# EAGLE design brick_serial_usb (EAGLE 7.4.0)
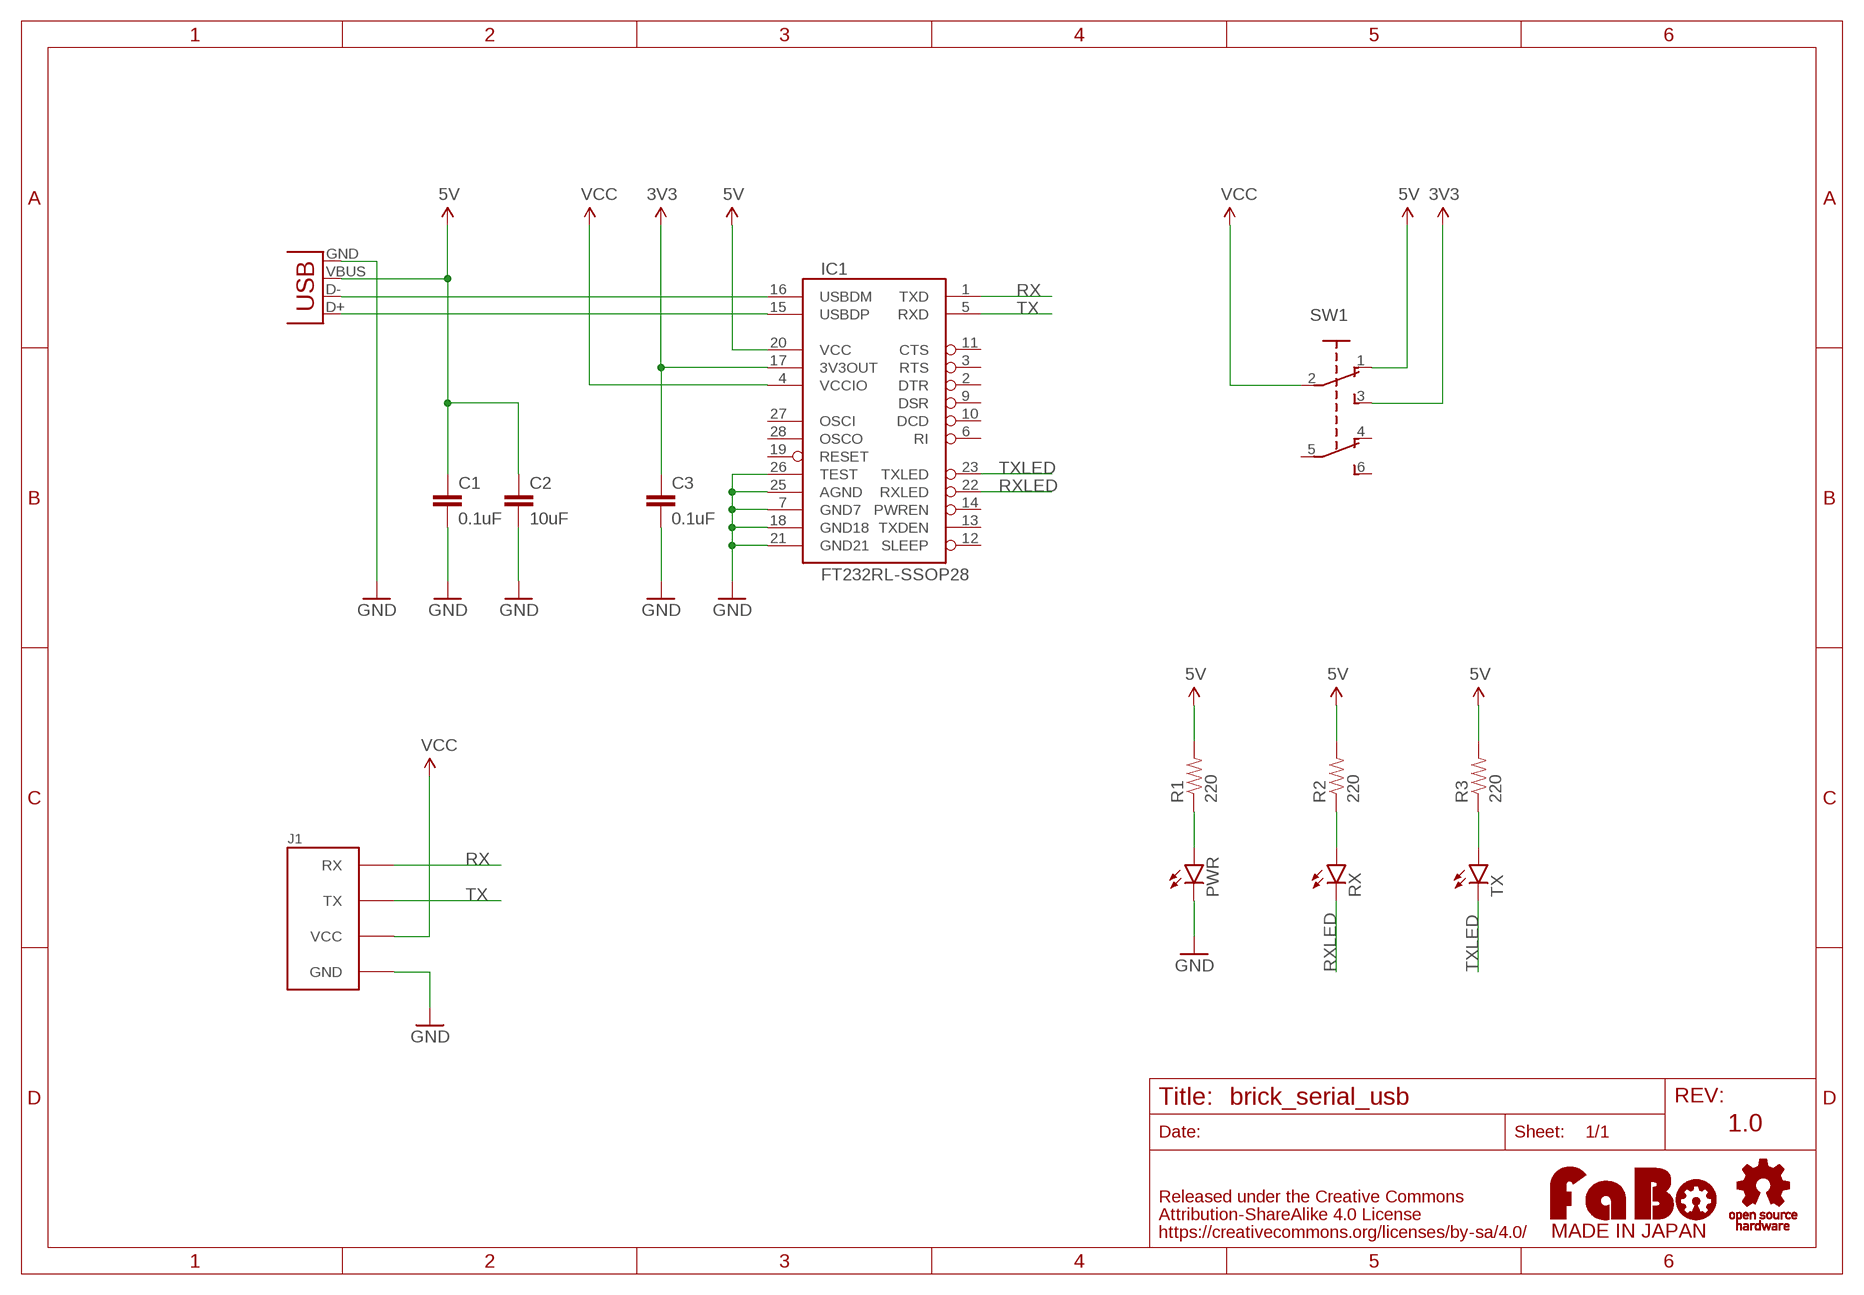
[diagram p0: schematic, sheet 1]

## Parts
C1  0.1uF  CAP-EIA0603  [EIA0603]
C2  10uF  CAP-EIA0603  [EIA0603]
C3  0.1uF  CAP-EIA0603  [EIA0603]
IC1  FT232RL-SSOP28  [SSOP28]
J1  FABO_BRICK_SERIAL  [FABO_BRICK_SERIAL]
JP1  USB-B-MICRO_SMD  [USB_B_MICRO]
PWR  LED-EIA0603  [EIA0603-LED]
R1  220  RES-EIA0603  [EIA0603]
R2  220  RES-EIA0603  [EIA0603]
R3  220  RES-EIA0603  [EIA0603]
RX  LED-EIA0603  [EIA0603-LED]
SW1  SWITCH-SLIDE_2C2P-JS202011SCQN  [C&K_JS202011SCQN]
TX  LED-EIA0603  [EIA0603-LED]
U$5  LOGO_OSHW-T_M_BOTTOM  [LOGO_OSHW_T_M_BOTTOM]
U$6  LOGO_FABO-M  [LOGO_FABO_M]

## Nets
3V3: C3.1 IC1.17(3V3OUT) SW1.3
5V: C1.1 C2.1 IC1.20(VCC) JP1.VBUS R1.2 R2.2 R3.2 SW1.1
GND: C1.2 C2.2 C3.2 IC1.7(GND7) IC1.18(GND18) IC1.21(GND21) IC1.25(AGND) IC1.26(TEST) J1.GND JP1.GND PWR.C
N$1: PWR.A R1.1
N$2: R3.1 TX.A
N$3: R2.1 RX.A
RX: IC1.1(TXD) J1.RX
RXLED: IC1.22(RXLED) RX.C
TX: IC1.5(RXD) J1.TX
TXLED: IC1.23(TXLED) TX.C
USBDM: IC1.16(USBDM) JP1.D-
USBDP: IC1.15(USBDP) JP1.D+
VCC: IC1.4(VCCIO) J1.VCC SW1.2
Unconnected: IC1.2(DTR) IC1.3(RTS) IC1.6(RI) IC1.9(DSR) IC1.10(DCD) IC1.11(CTS) IC1.12(SLEEP) IC1.13(TXDEN) IC1.14(PWREN) IC1.19(RESET) IC1.27(OSCI) IC1.28(OSCO) SW1.4 SW1.5 SW1.6

## Notes on the sheet
- 1.0

## Library data of the parts
C1-C3 = FaBo-etc:CAP: Capacitor Standard 0603 ceramic capacitor
IC1 = FaBo-etc:FT232RL: FT232RL FTDI FT232RL USB to serial UART interface SSOP28
J1 = FaBo-Template:FABO_BRICK_SERIAL: FaBo Brick Serial
JP1 = FaBo-etc:USB: USB Female
PWR RX TX = FaBo-etc:LED: LED
R1-R3 = FaBo-etc:RES
SW1 = FaBo-etc:SWITCH-SLIDE_2C2P
U$5 = FaBo-etc:LOGO_OSHW
U$6 = FaBo-etc:LOGO_FABO

## Net classes
0 default: width 0.203 mm

## Board
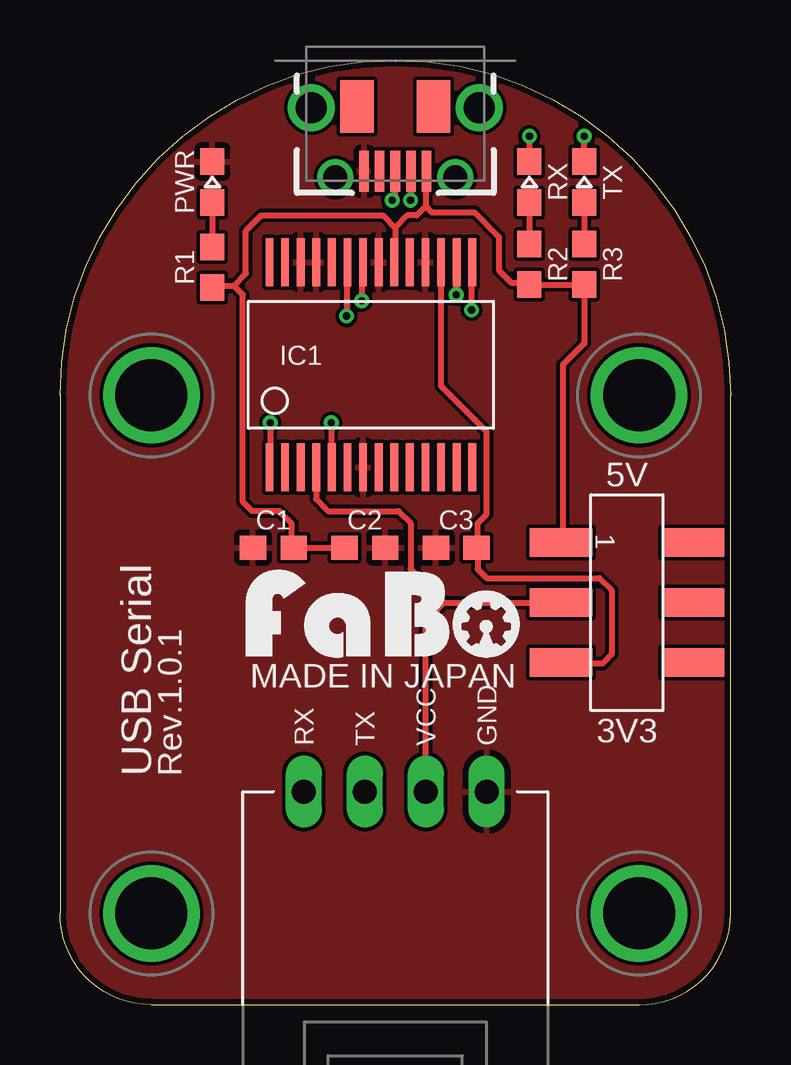
[diagram p1: board, top side]
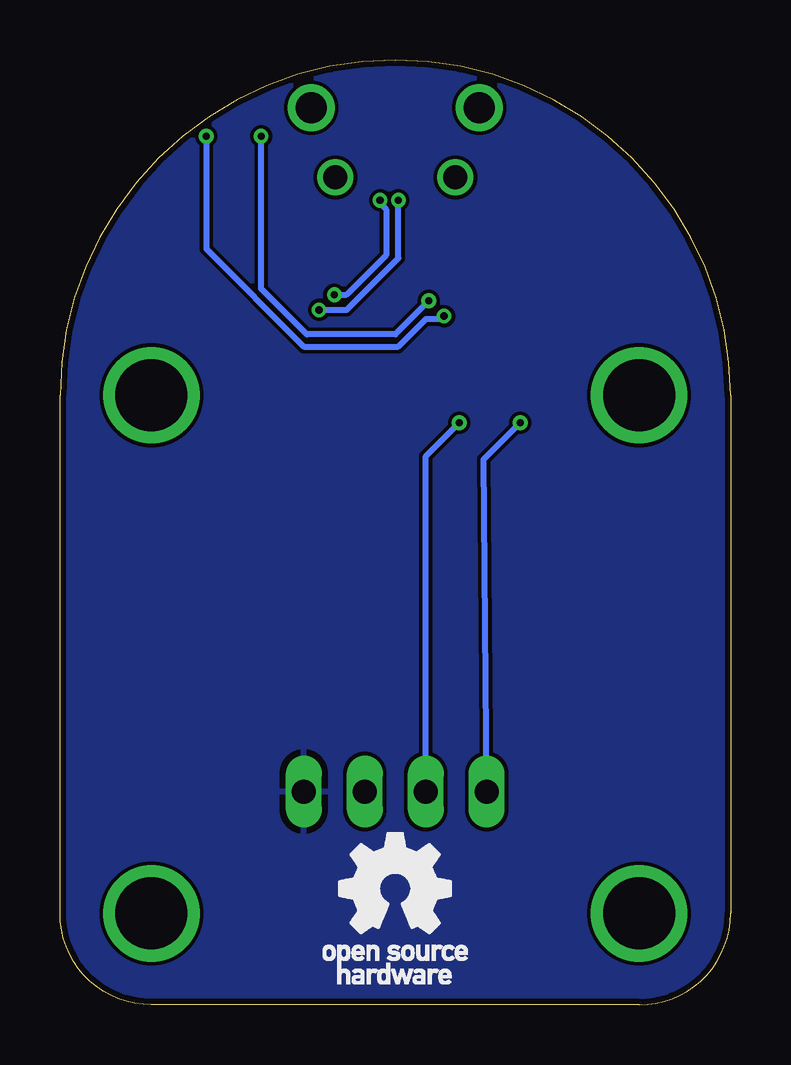
[diagram p2: board, bottom side, seen from below]

Size 27.94 x 39.37 mm. Coordinates in mm from the lower left corner, seen from the top.
Copper layers (1*16): Top 0.035mm / dielectric 1.5mm / Bottom 0.035mm
Design rules "Elecrow_2-layer_eagle_rule": minimum track width 6mil, minimum drill 12mil, track to track 6mil, track to pad 6mil, pad to pad 6mil, via to via 6mil, smd to smd 0mil, copper to edge 10mil, drill to drill 10mil, minimum pad ring 10mil, minimum via ring 6mil, stop-mask expansion 2mil, vias tented up to drill 100mil, thermal gap 10mil

### Footprints (pad centres in the part's own frame; a part is rotated, then mirrored left to right if it is on the bottom)
EIA0603 = smd 1.1 x 1: 1 -0.85,0; 2 0.85,0
SSOP28 = smd 0.325 x 2: 1 -4.225,-4.275; 2 -3.575,-4.275; 3 -2.925,-4.275; 4 -2.275,-4.275; 5 -1.625,-4.275; 6 -0.975,-4.275; 7 -0.325,-4.275; 8 0.325,-4.275; 9 0.975,-4.275; 10 1.625,-4.275; 11 2.275,-4.275; 12 2.925,-4.275; 13 3.575,-4.275; 14 4.225,-4.275; 15 4.225,4.275; 16 3.575,4.275; 17 2.925,4.275; 18 2.275,4.275; 19 1.625,4.275; 20 0.975,4.275; 21 0.325,4.275; 22 -0.325,4.275; 23 -0.975,4.275; 24 -1.625,4.275; 25 -2.275,4.275; 26 -2.925,4.275; 27 -3.575,4.275; 28 -4.225,4.275
FABO_BRICK_SERIAL = drill 1 long: GND 3.81,-10.16; RX -3.81,-10.16; TX -1.27,-10.16; VCC 1.27,-10.16 | drill 3 pad 3.81: P$5 -10.16,6.35; P$6 10.16,6.35; P$7 -10.16,-15.24; P$8 10.16,-15.24
USB_B_MICRO = smd 1.7 x 0.4: D+ 2.1,0; D- 2.1,0.65; GND 2.1,-1.3; ID 2.1,-0.65; VBUS 2.1,1.3 | drill 1 pad 1.4: P$1 2.35,2.5; P$2 2.35,-2.5 | drill 1.3 pad 1.7: P$3 -0.55,3.5; P$4 -0.55,-3.5 | smd 2.2 x 1.4: P$6 -0.6,1.6; P$7 -0.6,-1.6
EIA0603-LED = smd 1.1 x 1: A -0.85,0; C 0.85,0
C&K_JS202011SCQN = smd 2.6 x 1.2: 1 -2.75,2.5; 2 -2.75,0; 3 -2.75,-2.5; 4 2.75,2.5; 5 2.75,0; 6 2.75,-2.5

### Placement (x,y rotation side)
C1  8.89,19.05 180 top
C2  12.7,19.05 0 top
C3  16.51,19.05 180 top
IC1  12.95,26.67 0 top
J1  13.97,19.05 0 top
JP1  13.97,36.83 270 top
PWR  6.35,34.29 90 top
R1  6.35,30.73 270 top
R2  19.56,30.86 270 top
R3  21.84,30.86 270 top
RX  19.56,34.29 90 top
SW1  23.62,16.76 0 top
TX  21.84,34.29 90 top
U$5  13.97,4.83 0 top
U$6  13.46,14.48 0 top

### Tracks (layer width: path | path; a pad name or v marks a point on that pad's centre or on a via)
3V3
  Top 0.254: IC1.17 15.88,29.98 15.88,29.97 15.88,25.78 17.78,23.88 17.78,20.45 17.4,20.07 17.4,19.43 17.36,19.39 C3.1 17.4,19.01 17.4,18.16 17.78,17.78 22.48,17.78 22.99,17.27 22.99,14.61 22.61,14.22 21.84,14.22 21.8,14.26 SW1.3
5V
  Top 0.254: JP1.VBUS 15.27,34.07 15.24,34.04 15.24,33.27 | 15.24,33.27 14.86,32.89 14.48,32.89 13.97,32.38 | 13.97,32.38 13.97,30.99 IC1.20 | R1.2 6.64,29.88 6.73,29.97 7.24,29.97 | 7.24,29.97 7.75,30.48 7.75,32.26 8.38,32.89 13.46,32.89 13.97,32.38 | 15.24,33.27 15.49,33.02 17.27,33.02 18.29,32 18.29,30.61 18.8,30.1 19.47,30.1 R2.2 R3.2 21.84,27.56 20.95,26.67 20.95,19.35 SW1.1 | 7.24,29.97 7.62,29.59 7.62,20.95 8,20.57 9.14,20.57 9.65,20.07 9.65,19.14 C1.1 C2.1
GND
  pour Bottom: -1.27,-1.27 29.21,-1.27 29.21,40.64 -1.27,40.64
  pour Top: -1.27,-1.27 29.21,-1.27 29.21,40.64 -1.27,40.64
N$1
  Top 0.254: PWR.A R1.1
N$2
  Top 0.254: TX.A R3.1
N$3
  Top 0.254: RX.A R2.1
RX  (via drill 0.3)
  Top 0.254: v8.76,24.26 8.76,23.24 8.73,23.21 IC1.1
  Bottom 0.254: J1.RX 10.29,22.73 v8.76,24.26
RXLED  (via drill 0.3)
  Top 0.254: IC1.22 12.63,30.04 12.57,29.97 v12.57,29.34 | v19.56,36.2 RX.C
  Bottom 0.254: v12.57,29.34 13.97,27.94 17.65,27.94 19.56,29.84 v19.56,36.2
TX  (via drill 0.3)
  Top 0.254: v11.3,24.26 11.3,23.24 11.33,23.14 IC1.5
  Bottom 0.254: J1.TX 12.7,22.86 v11.3,24.26
TXLED  (via drill 0.3)
  Top 0.254: IC1.23 11.98,30.01 11.94,29.97 v11.94,28.7 | TX.C v21.84,36.2
  Bottom 0.254: v11.94,28.7 12.06,28.57 12.7,28.57 13.84,27.43 17.78,27.43 21.84,31.5 v21.84,36.2
USBDM  (via drill 0.3)
  Top 0.254: JP1.D- 14.62,33.92 14.61,33.91 v14.61,33.53 | IC1.16 16.53,29.99 16.51,29.97 v16.51,29.59
  Bottom 0.254: v14.61,33.53 14.61,33.4 14.35,33.15 14.35,31.24 16,29.59 v16.51,29.59
USBDP  (via drill 0.3)
  Top 0.254: IC1.15 17.18,30.07 17.14,29.97 v17.14,28.96 | v13.84,33.53 13.97,33.66 JP1.D+
  Bottom 0.254: v17.14,28.96 16,28.96 13.84,31.11 v13.84,33.53
VCC
  Top 0.254: IC1.4 10.68,21.47 10.67,21.46 10.67,21.08 11.18,20.57 14.1,20.57 14.61,20.07 14.61,18.16 16,16.76 | 16,16.76 SW1.2 | J1.VCC 15.24,16 16,16.76

### Text on the board
tPlace: 5V | MADE IN JAPAN | 3V3 | USB Serial | Rev.1.0.1